# EAGLE design isl3 (EAGLE 7.5.0)
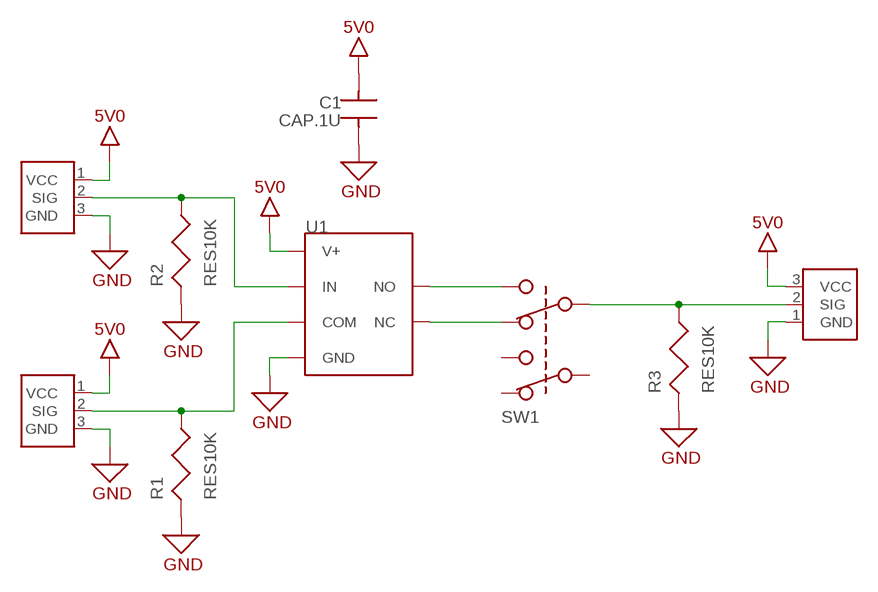
[diagram p0: schematic, sheet 1]

## Parts
C1  CAP.1U  [SMT0603]
J1  BITSNAPINPUT  [BITSNAP_INPUT_MALE]
J2  BITSNAPOUTPUT  [BITSNAP_OUTPUT_FEMALE]
J3  BITSNAPINPUT  [BITSNAP_INPUT_MALE]
R1  RES10K  [SMT0603]
R2  RES10K  [SMT0603]
R3  RES10K  [SMT0603]
SW1  AYZ0202AGRLC  [AYZ0202AGRLC]
U1  TS5A3160DBVR  [SOT23-6]

## Nets
5V0: C1.2 J1.1(VCC) J2.3(VCC) J3.1(VCC) U1.5(V+)
GND: C1.1 J1.3(GND) J2.1(GND) J3.3(GND) R1.1 R2.1 R3.1 U1.2(GND)
N$1: J1.2(SIG) R2.2 U1.6(IN)
N$2: J3.2(SIG) R1.2 U1.4(COM)
N$3: SW1.6(NO_B) U1.1(NO)
N$4: SW1.4(NC_B) U1.3(NC)
N$5: J2.2(SIG) R3.2 SW1.5(COM_B)
Unconnected: SW1.1(NC_A) SW1.2(COM_A) SW1.3(NO_A)

## Library data of the parts
C1 = Common:CAP.1U; MFR: Murata; MPN: GRM188R71H104KA93D; VND: DigiKey; VPN: 490-1519-6-ND
J1-J3 = BitLab:BITSNAP
R1-R3 = Common:RES10K; MFR: Panasonic; MPN: ERJ-3EKF1002V; VND: DigiKey; VPN: P10.0KHDKR-ND
SW1 = BitLab:AYZ0202AGRLC
U1 = BitLab:TS5A3160DBVR

## Board
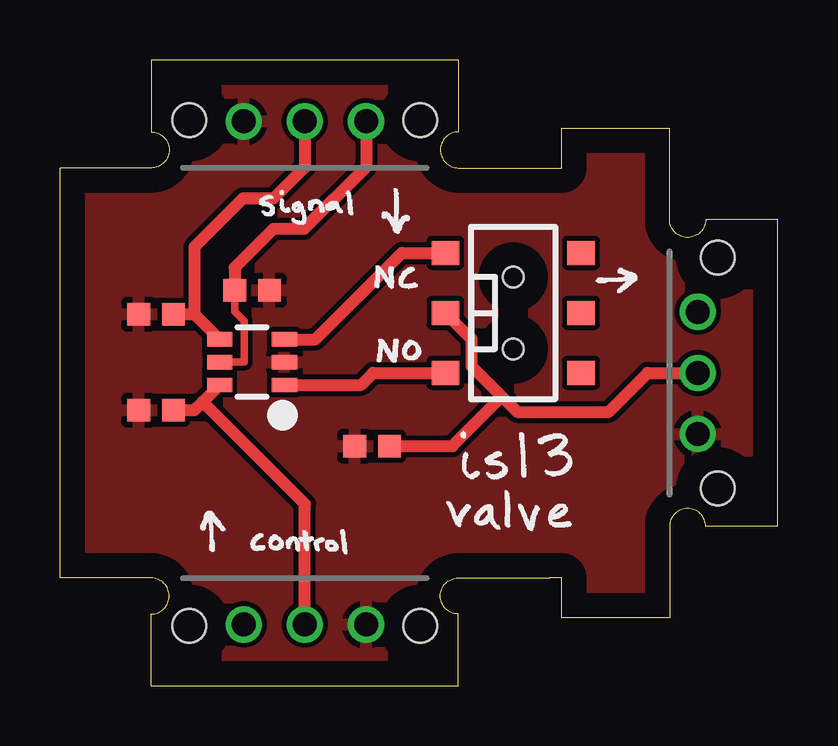
[diagram p1: board, top side]
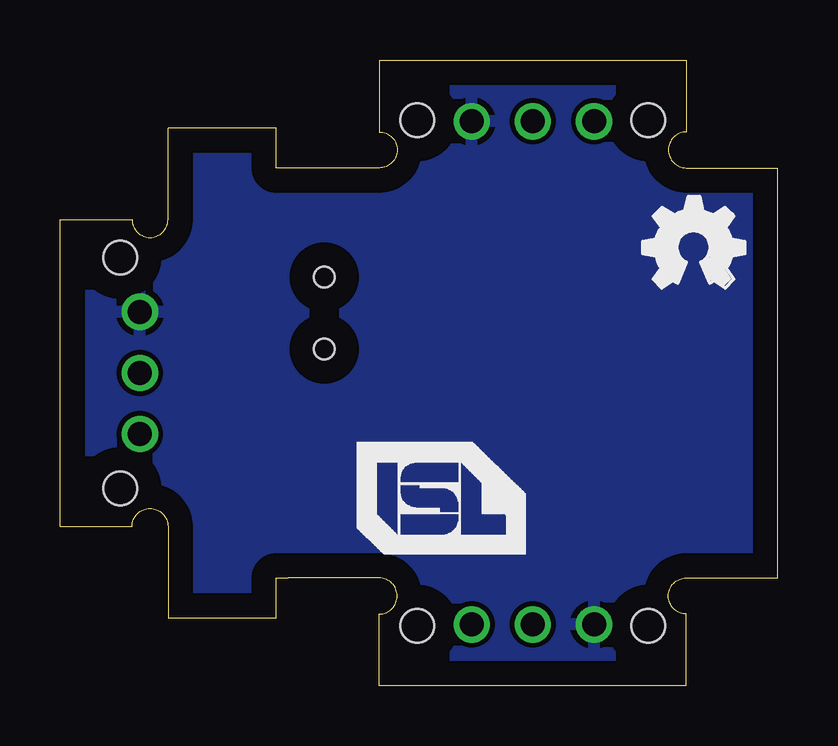
[diagram p2: board, bottom side, seen from below]

Size 29.9 x 26.1 mm. Coordinates in mm from the lower left corner, seen from the top.
Outline: 0,4.5 0,21.6
Outline: 25.4,2.85 20.9,2.85 20.9,4.5 20.4,4.5
Outline: 20.4,21.6 20.9,21.6 20.9,23.25 25.4,23.25
Copper layers (1*16): Top 0.035mm / dielectric 1.5mm / Bottom 0.035mm
Design rules "default": minimum track width 10mil, minimum drill 24mil, track to track 8mil, track to pad 8mil, pad to pad 8mil, via to via 8mil, smd to smd 8mil, copper to edge 40mil, drill to drill 8mil, minimum pad ring 10mil, minimum via ring 8mil, stop-mask expansion 4mil, vias tented up to drill 0mil, thermal gap 10mil

### Footprints (pad centres in the part's own frame; a part is rotated, then mirrored left to right if it is on the bottom)
SMT0603 = smd 0.95 x 0.95: 1 -0.725,0; 2 0.725,0
BITSNAP_INPUT_MALE = drill 1: 1 -2.55,2.56; 2 0,2.56; 3 2.55,2.56 | hole 1.4: -4.82,2.5; 4.82,2.5
BITSNAP_OUTPUT_FEMALE = drill 1: 1 -2.55,3.33; 2 0,3.33; 3 2.55,3.33 | hole 1.4: -4.82,2.5; 4.82,2.5
AYZ0202AGRLC = smd 1 x 1.15: 1 -2.5,2.825; 2 0,2.825; 3 2.5,2.825; 4 -2.5,-2.825; 5 0,-2.825; 6 2.5,-2.825 | hole 0.85: -1.5,0; 1.5,0
SOT23-6 = smd 0.6 x 1.05: 1 -0.95,-1.35; 2 0,-1.35; 3 0.95,-1.35; 4 0.95,1.35; 5 0,1.35; 6 -0.95,1.35

### Placement (x,y rotation side)
C1  8,16.5 180 top
J1  10.2,0 0 top
J2  29.9,13.05 90 top
J3  10.2,26.1 180 top
R1  4,15.5 0 top
R2  4,11.5 0 top
R3  13,10 0 top
SW1  18.89,15.55 270 top
U1  8,13.5 90 top
U$10  [OSHW_FILLX150_NOTEXT]  6.45,16.6 90 top
U$11  [ISL_LOGO]  17.6,5.35 0 bottom
U$12  [ISL3_LABEL]  18.9,8.5 0 top
U$13  [ARROW]  6.33,6.41 90 top
U$14  [ARROW2]  14.03,19.8 270 top
U$18  [ARROW]  23.16,16.92 0 top
U$19  [NC_LABEL]  14,17 0 top
U$20  [NO_LABEL]  14,14 0 top
U$21  [SIGNAL_LABEL]  10.2,20 0 top
U$22  [CONTROL_LABEL]  10.2,6 0 top

### Tracks (layer width: path | path; a pad name or v marks a point on that pad's centre or on a via)
5V0
  Top 0.305: U1.5 7.67,13.5 7.67,15.21 7.28,15.61 C1.2
  Top 0.508: J3.1 12.75,21.64 10.16,19.05 8.89,19.05 7.28,17.43 C1.2
  pour Bottom: 0,0 30.48,0 30.48,26.67 0,26.67
GND
  pour Top: 0,0 30.48,0 30.48,26.67 0,26.67
N$1
  Top 0.508: R2.2 5.6,11.5 5.94,11.84 | 5.94,11.84 U1.6 | J1.2 10.2,7.58 5.94,11.84
N$2
  Top 0.508: R1.2 5.6,15.5 | 5.6,15.5 U1.4 | J3.2 10.2,21.63 8.89,20.32 7.62,20.32 5.6,18.3 5.6,15.5
N$3
  Top 0.508: U1.1 12.55,12.55 13.05,13.05 SW1.6
N$4
  Top 0.508: U1.3 10.64,14.45 14.24,18.05 SW1.4
N$5
  Top 0.508: SW1.5 17.14,14.46 17.14,13.34 18.41,12.06 | 18.41,12.06 19.05,11.43 22.86,11.43 24.48,13.05 J2.2 | R3.2 16.35,10 18.41,12.06